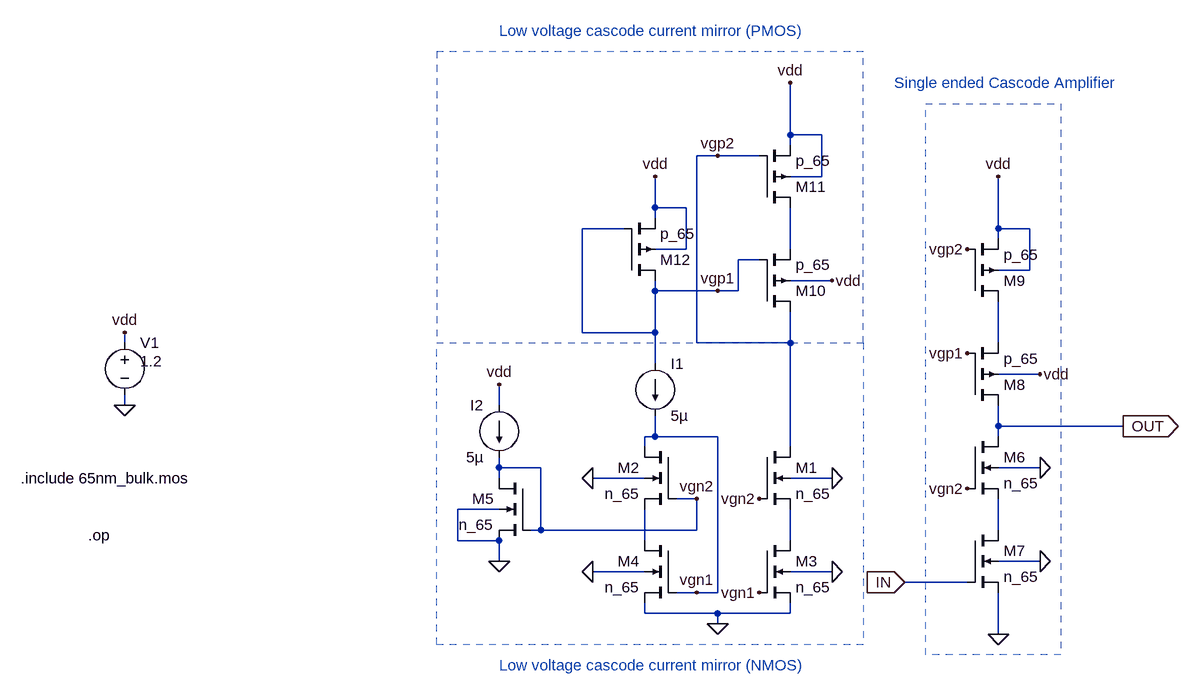
[diagram p0: schematic Cascode_stage.asc]
Cascode_stage.asc, the LTspice schematic file:
Version 4.1
SHEET 1 1208 820
WIRE -432 -208 -432 -288
WIRE -384 -208 -432 -208
WIRE -432 -192 -432 -208
WIRE -544 -176 -576 -176
WIRE -480 -176 -544 -176
WIRE -384 -144 -384 -208
WIRE -384 -144 -432 -144
WIRE -640 -96 -640 -144
WIRE -592 -96 -640 -96
WIRE -640 -80 -640 -96
WIRE -688 -64 -752 -64
WIRE -112 -64 -112 -144
WIRE -64 -64 -112 -64
WIRE -112 -48 -112 -64
WIRE -592 -32 -592 -96
WIRE -592 -32 -640 -32
WIRE -432 -32 -432 -96
WIRE -480 -16 -512 -16
WIRE -64 0 -64 -64
WIRE -64 0 -112 0
WIRE -368 16 -432 16
WIRE -640 32 -640 16
WIRE -544 32 -640 32
WIRE -512 32 -512 -16
WIRE -512 32 -544 32
WIRE -752 96 -752 -64
WIRE -640 96 -640 32
WIRE -640 96 -752 96
WIRE -1456 112 -1456 96
WIRE -576 112 -576 -176
WIRE -432 112 -432 64
WIRE -432 112 -576 112
WIRE -112 112 -112 48
WIRE -640 144 -640 96
WIRE -48 160 -112 160
WIRE -1456 208 -1456 192
WIRE -880 208 -880 176
WIRE -112 240 -112 208
WIRE 80 240 -112 240
WIRE -640 256 -640 224
WIRE -640 256 -656 256
WIRE -544 256 -640 256
WIRE -112 256 -112 240
WIRE -656 272 -656 256
WIRE -432 272 -432 112
WIRE -880 304 -880 288
WIRE -816 304 -880 304
WIRE -48 304 -112 304
WIRE -880 320 -880 304
WIRE -656 320 -736 320
WIRE -368 320 -432 320
WIRE -576 352 -608 352
WIRE -880 368 -944 368
WIRE -816 400 -816 304
WIRE -816 400 -832 400
WIRE -576 400 -576 352
WIRE -576 400 -816 400
WIRE -112 400 -112 352
WIRE -944 416 -944 368
WIRE -880 416 -944 416
WIRE -656 416 -656 368
WIRE -432 416 -432 368
WIRE -880 448 -880 416
WIRE -48 448 -112 448
WIRE -656 464 -736 464
WIRE -368 464 -432 464
WIRE -160 480 -256 480
WIRE -576 496 -608 496
WIRE -544 496 -544 256
WIRE -544 496 -576 496
WIRE -656 528 -656 512
WIRE -544 528 -656 528
WIRE -432 528 -432 512
WIRE -432 528 -544 528
WIRE -544 544 -544 528
WIRE -112 560 -112 496
FLAG -1456 208 0
FLAG -1456 96 vdd
FLAG -736 464 0
FLAG -544 544 0
FLAG -736 320 0
FLAG -368 320 0
FLAG -880 176 vdd
FLAG -880 448 0
FLAG -368 464 0
FLAG -112 -144 vdd
FLAG -48 160 vdd
FLAG -576 352 vgn2
FLAG -576 496 vgn1
FLAG -432 -288 vdd
FLAG -368 16 vdd
FLAG -640 -144 vdd
FLAG -480 496 vgn1
FLAG -480 352 vgn2
FLAG -48 304 0
FLAG -48 448 0
FLAG -160 336 vgn2
FLAG -112 560 0
FLAG -544 32 vgp1
FLAG -544 -176 vgp2
FLAG -160 -32 vgp2
FLAG -160 128 vgp1
FLAG 80 240 OUT
IOPIN 80 240 Out
FLAG -256 480 IN
IOPIN -256 480 In
SYMBOL nmos4 -480 272 R0
SYMATTR InstName M1
SYMATTR Value n_65
SYMATTR Value2 l=100n w=10u
SYMBOL nmos4 -608 272 M0
SYMATTR InstName M2
SYMATTR Value n_65
SYMATTR Value2 l=100n w=10u
SYMBOL current -640 144 R0
WINDOW 123 0 0 Left 0
WINDOW 39 0 0 Left 0
SYMATTR InstName I1
SYMATTR Value 5µ
SYMBOL voltage -1456 96 R0
WINDOW 3 24 44 Left 2
WINDOW 123 0 0 Left 0
WINDOW 39 0 0 Left 0
SYMATTR Value 1.2
SYMATTR InstName V1
SYMBOL nmos4 -480 416 R0
SYMATTR InstName M3
SYMATTR Value n_65
SYMATTR Value2 l=100n w=10u
SYMBOL nmos4 -608 416 M0
SYMATTR InstName M4
SYMATTR Value n_65
SYMATTR Value2 l=100n w=10u
SYMBOL current -880 208 M0
WINDOW 123 0 0 Left 0
WINDOW 39 0 0 Left 0
SYMATTR InstName I2
SYMATTR Value 5µ
SYMBOL nmos4 -832 320 M0
SYMATTR InstName M5
SYMATTR Value n_65
SYMATTR Value2 l=100n w=2.5u
SYMBOL pmos4 -160 208 M180
SYMATTR InstName M8
SYMATTR Value p_65
SYMATTR Value2 l=100n w=10u
SYMBOL pmos4 -160 48 M180
SYMATTR InstName M9
SYMATTR Value p_65
SYMATTR Value2 l=100n w=10u
SYMBOL pmos4 -480 64 M180
SYMATTR InstName M10
SYMATTR Value p_65
SYMATTR Value2 l=100n w=10u
SYMBOL pmos4 -480 -96 M180
SYMATTR InstName M11
SYMATTR Value p_65
SYMATTR Value2 l=100n w=10u
SYMBOL pmos4 -688 16 M180
SYMATTR InstName M12
SYMATTR Value p_65
SYMATTR Value2 l=100n w=2.5u
SYMBOL nmos4 -160 256 R0
SYMATTR InstName M6
SYMATTR Value n_65
SYMATTR Value2 l=100n w=10u
SYMBOL nmos4 -160 400 R0
SYMATTR InstName M7
SYMATTR Value n_65
SYMATTR Value2 l=100n w=10u
TEXT -1616 320 Left 2 !.include 65nm_bulk.mos
TEXT -880 608 Left 2 ;Low voltage cascode current mirror (NMOS)
TEXT -880 -368 Left 2 ;Low voltage cascode current mirror (PMOS)
TEXT -272 -288 Left 2 ;Single ended Cascode Amplifier
TEXT -1512 408 Left 2 !.op
RECTANGLE Normal -320 -336 -976 112 2
RECTANGLE Normal -320 576 -976 112 2
RECTANGLE Normal -16 592 -224 -256 2

The netlist it stands for:
* Cascode_stage.asc
M1 vgp2 vgn2 N005 0 n_65 l=100n w=10u
M2 vgn1 vgn2 N004 0 n_65 l=100n w=10u
I1 vgp1 vgn1 5µ
V1 vdd 0 1.2
M3 N005 vgn1 0 0 n_65 l=100n w=10u
M4 N004 vgn1 0 0 n_65 l=100n w=10u
I2 vdd vgn2 5µ
M5 vgn2 vgn2 0 0 n_65 l=100n w=2.5u
M8 OUT vgp1 N002 vdd p_65 l=100n w=10u
M9 N002 vgp2 vdd vdd p_65 l=100n w=10u
M10 vgp2 vgp1 N001 vdd p_65 l=100n w=10u
M11 N001 vgp2 vdd vdd p_65 l=100n w=10u
M12 vgp1 vgp1 vdd vdd p_65 l=100n w=2.5u
M6 OUT vgn2 N003 0 n_65 l=100n w=10u
M7 N003 IN 0 0 n_65 l=100n w=10u
.model NMOS NMOS
.model PMOS PMOS
.lib standard.mos
.include 65nm_bulk.mos
* Low voltage cascode current mirror (NMOS)
* Low voltage cascode current mirror (PMOS)
* Single ended Cascode Amplifier
.op
.backanno
.end